# Altium schematic sheet fpga-bank0.SchDoc: Copper Suicide - FPGA - Bank 0
size Letter; CheckedBy: J. Brinton; CompanyName: Signal Laboratories, Inc.; DrawnBy: J. Brinton; Engineer: J. Brinton; Address1: 3479 Edison Way; Address2: Menlo Park CA 94025; Address3: +1 (877) 778-8435; Address4: siglabs.com; Revision: 3; SheetNumber: 5; SheetTotal: 47
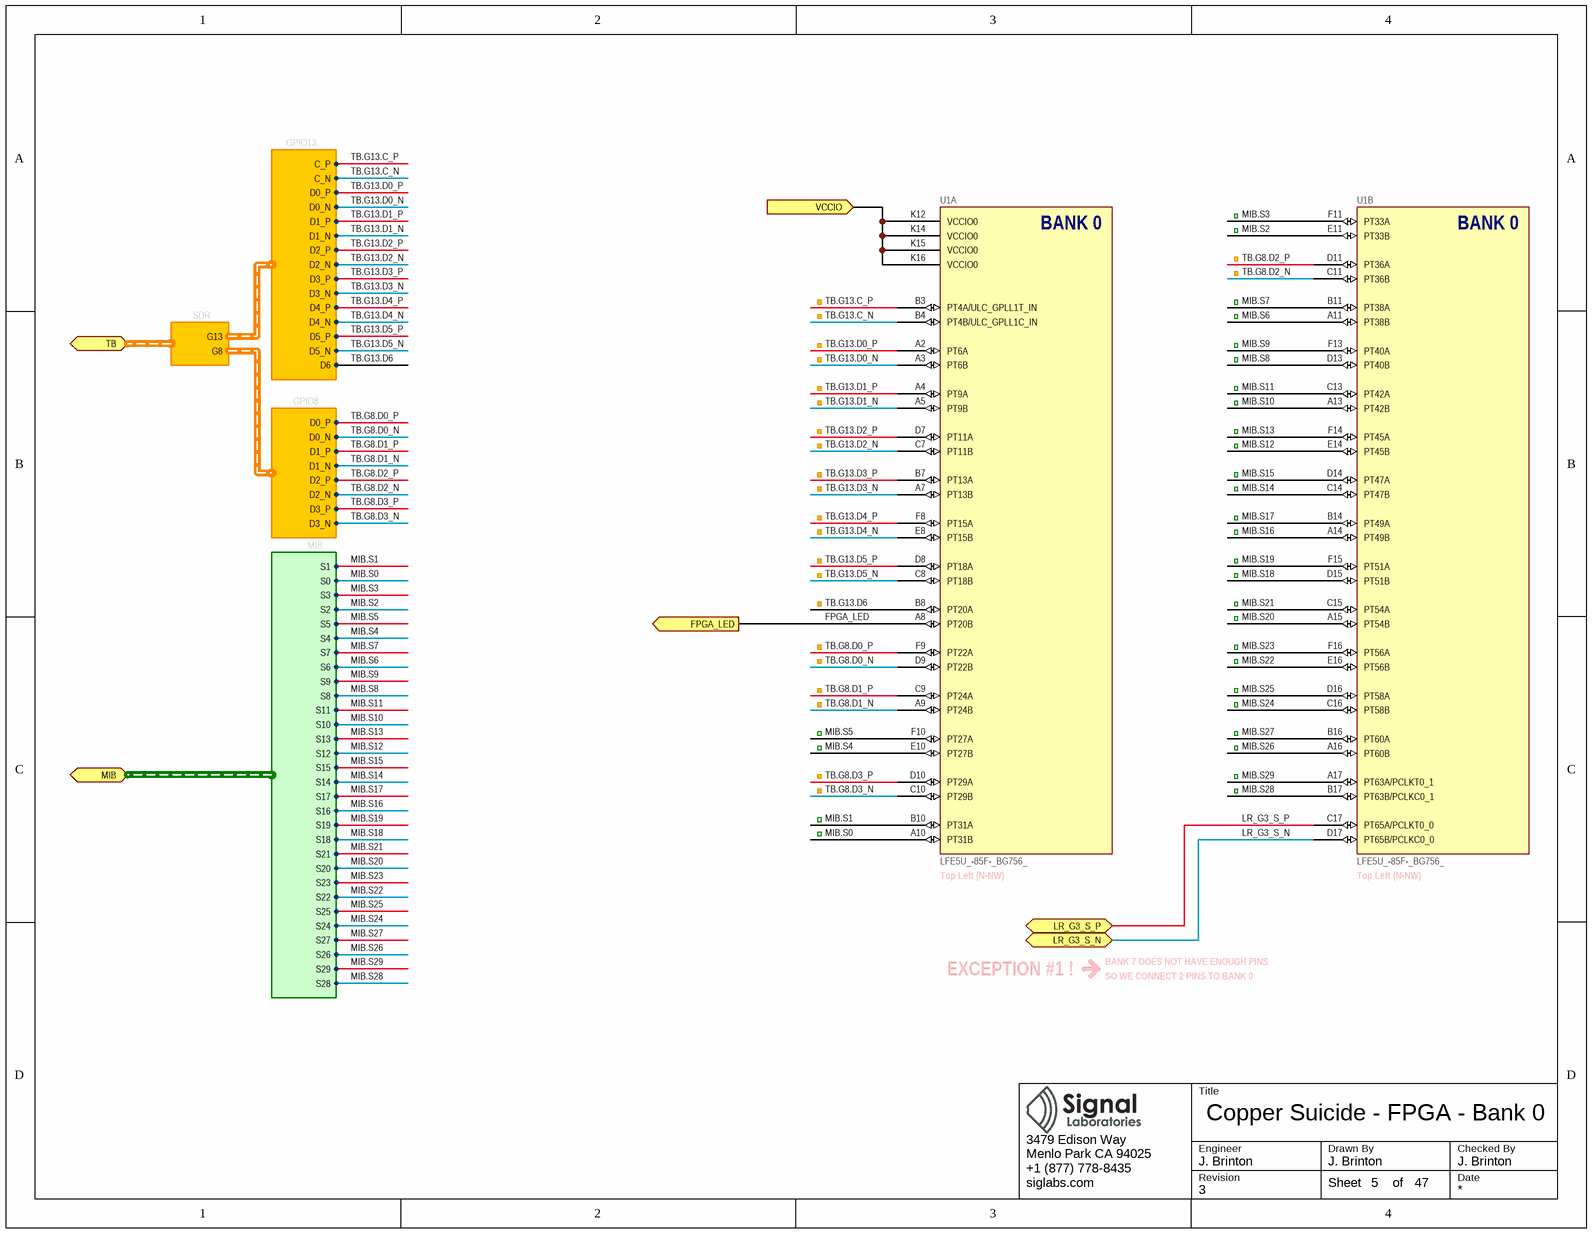
[diagram p0: fpga-bank0.SchDoc]

## Parts
U1  LFE5U_-85F-_BG756_  [caBGA756]  (parts A,B of 19)

## Ports
FPGA_LED (out), LR_G3_S_N, LR_G3_S_P, MIB (harness MIB), TB (harness SDR), VCCIO (in)

## Harnesses
MIB: S1, S0, S3, S2, S5, S4, S7, S6, S9, S8, S11, S10, S13, S12, S15, S14, S17, S16, S19, S18, S21, S20, S23, S22, S25, S24, S27, S26, S29, S28
GPIO8: D0_P, D0_N, D1_P, D1_N, D2_P, D2_N, D3_P, D3_N
SDR: G13, G8
GPIO13: C_P, C_N, D0_P, D0_N, D1_P, D1_N, D2_P, D2_N, D3_P, D3_N, D4_P, D4_N, D5_P, D5_N, D6

## Nets
FPGA_LED: U1.A8(PT20B) ; port FPGA_LED
LR_G3_S_N: U1.D17(PT65B/PCLKC0_0) ; port LR_G3_S_N
LR_G3_S_P: U1.C17(PT65A/PCLKT0_0) ; port LR_G3_S_P
MIB.S0: U1.A10(PT31B) ; port MIB.S0
MIB.S1: U1.B10(PT31A) ; port MIB.S1
MIB.S2: U1.E11(PT33B) ; port MIB.S2
MIB.S3: U1.F11(PT33A) ; port MIB.S3
MIB.S4: U1.E10(PT27B) ; port MIB.S4
MIB.S5: U1.F10(PT27A) ; port MIB.S5
MIB.S6: U1.A11(PT38B) ; port MIB.S6
MIB.S7: U1.B11(PT38A) ; port MIB.S7
MIB.S8: U1.D13(PT40B) ; port MIB.S8
MIB.S9: U1.F13(PT40A) ; port MIB.S9
MIB.S10: U1.A13(PT42B) ; port MIB.S10
MIB.S11: U1.C13(PT42A) ; port MIB.S11
MIB.S12: U1.E14(PT45B) ; port MIB.S12
MIB.S13: U1.F14(PT45A) ; port MIB.S13
MIB.S14: U1.C14(PT47B) ; port MIB.S14
MIB.S15: U1.D14(PT47A) ; port MIB.S15
MIB.S16: U1.A14(PT49B) ; port MIB.S16
MIB.S17: U1.B14(PT49A) ; port MIB.S17
MIB.S18: U1.D15(PT51B) ; port MIB.S18
MIB.S19: U1.F15(PT51A) ; port MIB.S19
MIB.S20: U1.A15(PT54B) ; port MIB.S20
MIB.S21: U1.C15(PT54A) ; port MIB.S21
MIB.S22: U1.E16(PT56B) ; port MIB.S22
MIB.S23: U1.F16(PT56A) ; port MIB.S23
MIB.S24: U1.C16(PT58B) ; port MIB.S24
MIB.S25: U1.D16(PT58A) ; port MIB.S25
MIB.S26: U1.A16(PT60B) ; port MIB.S26
MIB.S27: U1.B16(PT60A) ; port MIB.S27
MIB.S28: U1.B17(PT63B/PCLKC0_1) ; port MIB.S28
MIB.S29: U1.A17(PT63A/PCLKT0_1) ; port MIB.S29
TB.G8.D0_N: U1.D9(PT22B) ; harness GPIO8.D0_N
TB.G8.D0_P: U1.F9(PT22A) ; harness GPIO8.D0_P
TB.G8.D1_N: U1.A9(PT24B) ; harness GPIO8.D1_N
TB.G8.D1_P: U1.C9(PT24A) ; harness GPIO8.D1_P
TB.G8.D2_N: U1.C11(PT36B) ; harness GPIO8.D2_N
TB.G8.D2_P: U1.D11(PT36A) ; harness GPIO8.D2_P
TB.G8.D3_N: U1.C10(PT29B) ; harness GPIO8.D3_N
TB.G8.D3_P: U1.D10(PT29A) ; harness GPIO8.D3_P
TB.G13.C_N: U1.B4(PT4B/ULC_GPLL1C_IN) ; harness GPIO13.C_N
TB.G13.C_P: U1.B3(PT4A/ULC_GPLL1T_IN) ; harness GPIO13.C_P
TB.G13.D0_N: U1.A3(PT6B) ; harness GPIO13.D0_N
TB.G13.D0_P: U1.A2(PT6A) ; harness GPIO13.D0_P
TB.G13.D1_N: U1.A5(PT9B) ; harness GPIO13.D1_N
TB.G13.D1_P: U1.A4(PT9A) ; harness GPIO13.D1_P
TB.G13.D2_N: U1.C7(PT11B) ; harness GPIO13.D2_N
TB.G13.D2_P: U1.D7(PT11A) ; harness GPIO13.D2_P
TB.G13.D3_N: U1.A7(PT13B) ; harness GPIO13.D3_N
TB.G13.D3_P: U1.B7(PT13A) ; harness GPIO13.D3_P
TB.G13.D4_N: U1.E8(PT15B) ; harness GPIO13.D4_N
TB.G13.D4_P: U1.F8(PT15A) ; harness GPIO13.D4_P
TB.G13.D5_N: U1.C8(PT18B) ; harness GPIO13.D5_N
TB.G13.D5_P: U1.D8(PT18A) ; harness GPIO13.D5_P
TB.G13.D6: U1.B8(PT20A) ; harness GPIO13.D6
VCCIO: U1.K12(VCCIO0) U1.K14(VCCIO0) U1.K15(VCCIO0) U1.K16(VCCIO0) ; port VCCIO

## Notes on the sheet
- (near U1) Top Left (N-NW)
- EXCEPTION #1 !
- BANK 7 DOES NOT HAVE ENOUGH PINS
- SO WE CONNECT 2 PINS TO BANK 0
- Title
- Engineer
- Revision
- Drawn By
- Checked By
- Date
- Sheet
- of
- (in symbol LFE5U_-85F-_BG756_, part A) BANK 0
- (in symbol LFE5U_-85F-_BG756_, part B) BANK 0

## Library data of the parts
U1 = LFE5U_-85F-_BG756_: ECP5 FPGA, 85k LUT, 756-caBGA; Manufacturer: Lattice Semiconductor; Manufacturer P/N: LFE5U_-85F-_BG756_